# EAGLE design Sensors-V1 (EAGLE 9.6.2)
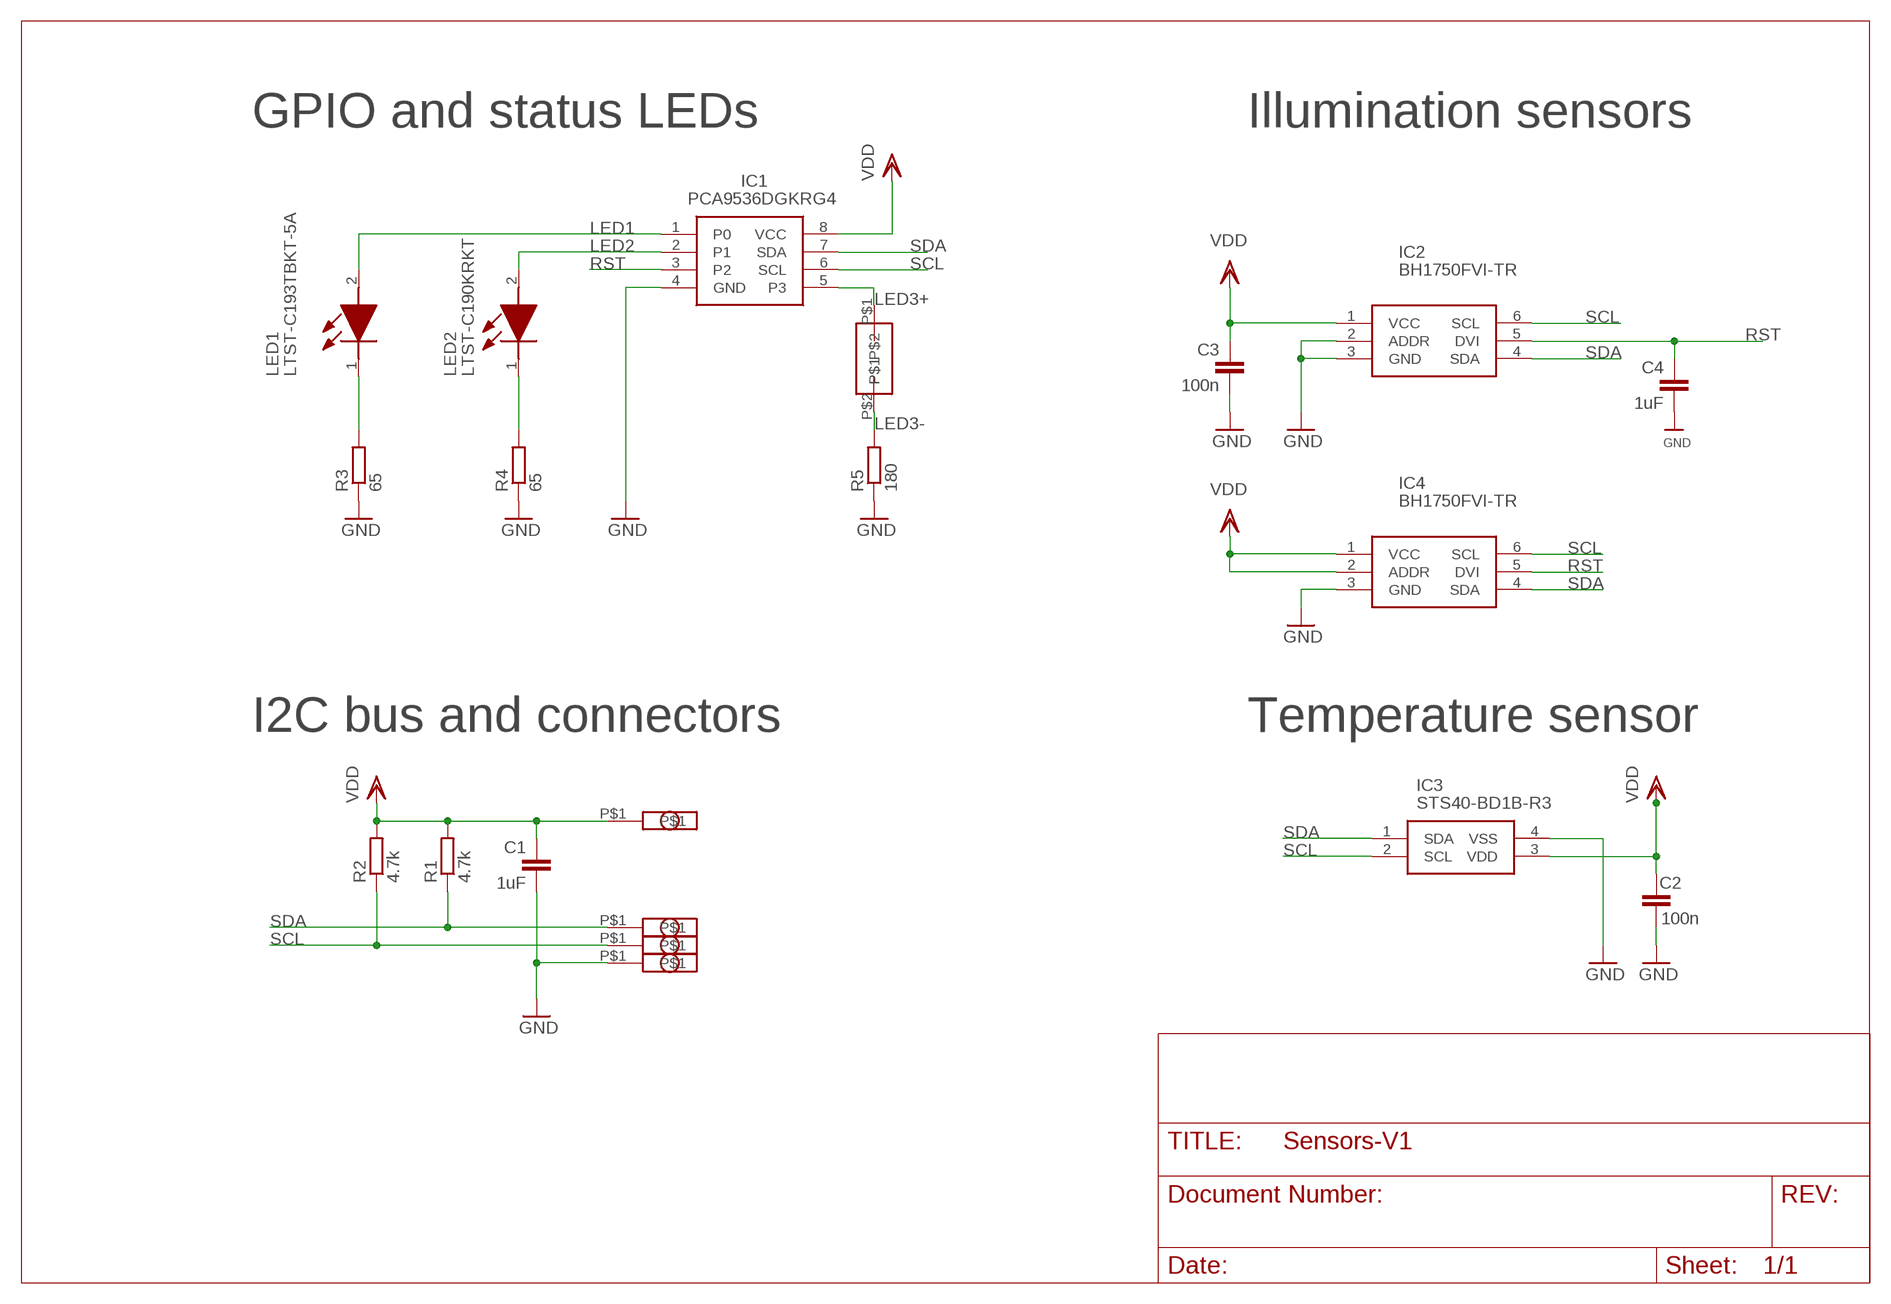
[diagram p0: schematic, sheet 1]

## Parts
C1  1uF  C-EUC0603  [C0603]
C2  100n  C-EUC0603  [C0603]
C3  100n  C-EUC0603  [C0603]
C4  1uF  C-EUC0603  [C0603]
IC1  PCA9536DGKRG4  [SOP65P490X110-8N]
IC2  BH1750FVI-TR  [WSOF6]
IC3  STS40-BD1B-R3  [STS40BD1BR3]
IC4  BH1750FVI-TR  [WSOF6]
LED1  LTST-C193TBKT-5A  [LEDC1608X45N]
LED2  LTST-C190KRKT  LTST-C190KFKT  [LEDC1607X80N]
R1  4.7k  R_JLMR0603  [R0603]
R2  4.7k  R_JLMR0603  [R0603]
R3  65  R_JLMR0603  [R0603]
R4  65  R_JLMR0603  [R0603]
R5  180  R_JLMR0603  [R0603]
U$1  PAD  [PAD-15]
U$2  PAD  [PAD-15]
U$3  PAD  [PAD-15]
U$4  PAD  [PAD-15]
U$5  LEDPINS  [LEDPINS254]

## Nets
GND: C1.2 C2.2 C3.2 C4.2 IC1.4(GND) IC2.2(ADDR) IC2.3(GND) IC3.4(VSS) IC4.3(GND) R3.1 R4.1 R5.1 U$3.P$1
LED1: IC1.1(P0) LED1.2(A)
LED2: IC1.2(P1) LED2.2(A)
LED3+: IC1.5(P3) U$5.P$1
LED3-: R5.2 U$5.P$2
N$1: LED1.1(K) R3.2
N$2: LED2.1(K) R4.2
RST: C4.1 IC1.3(P2) IC2.5(DVI) IC4.5(DVI)
SCL: IC1.6(SCL) IC2.6(SCL) IC3.2(SCL) IC4.6(SCL) R2.1 U$2.P$1
SDA: IC1.7(SDA) IC2.4(SDA) IC3.1(SDA) IC4.4(SDA) R1.1 U$1.P$1
VDD: C1.1 C2.1 C3.1 IC1.8(VCC) IC2.1(VCC) IC3.3(VDD) IC4.1(VCC) IC4.2(ADDR) R1.2 R2.2 U$4.P$1

## Notes on the sheet
- GPIO and status LEDs | Illumination sensors
- I2C bus and connectors | Temperature sensor

## Library data of the parts
C1-C4 = jlm_cap:C-EU: CAPACITOR, European symbol
IC1 = teensyamp:PCA9536DGKRG4: Interface - I/O Expanders Remote 4-Bit I2C and SMBus I/O Expander Source: Datasheet <https://www.ti.com/general/docs/suppproductinfo.tsp?distId=26&gotoUrl=http%3A%2F%2Fwww.ti.com%2Flit%2Fgpn%2Fpca9536>; DESCRIPTION: Interface - I/O Expanders Remote 4-Bit I2C and SMBus I/O Expander; HEIGHT: 1.1mm; MANUFACTURER_NAME: Texas Instruments; MANUFACTURER_PART_NUMBER: PCA9536DGKRG4; MOUSER_PART_NUMBER: 595-PCA9536DGKRG4; MOUSER_PRICE-STOCK: https://www.mouser.co.uk/ProductDetail/Texas-Instruments/PCA9536DGKRG4?qs=aEuGZpxfbxXPE5BN2fagwA%3D%3D
IC2 IC4 = teensyamp:BH1750FVI-TR: Ambient Light Sensor,16bit,I2C,WSOF6I ROHM BH1750FVI-TR Ambient Light Sensor Unit Surface Mount Source: Datasheet <https://componentsearchengine.com/Datasheets/2/BH1750FVI-TR.pdf>; DESCRIPTION: Ambient Light Sensor,16bit,I2C,WSOF6I ROHM BH1750FVI-TR Ambient Light Sensor Unit Surface Mount; HEIGHT: mm; MANUFACTURER_NAME: ROHM Semiconductor; MANUFACTURER_PART_NUMBER: BH1750FVI-TR
IC3 = teensyamp:STS40-BD1B-R3: Board Mount Temperature Sensors Base Accuracy Version, I2C Address 0x45 Source: Datasheet <https://sensirion.com/media/documents/D2D0B4A9/62CBE395/Sensirion_Datasheet_STS4x.pdf>; DESCRIPTION: Board Mount Temperature Sensors Base Accuracy Version, I2C Address 0x45; HEIGHT: 0.65mm; MANUFACTURER_NAME: Sensirion; MANUFACTURER_PART_NUMBER: STS40-BD1B-R3; MOUSER_PART_NUMBER: 403-STS40-BD1B-R3; MOUSER_PRICE-STOCK: https://www.mouser.co.uk/ProductDetail/Sensirion/STS40-BD1B-R3?qs=MyNHzdoqoQIARL3xuvj19A%3D%3D
LED1 = teensyamp:LTST-C193TBKT-5A: Standard LEDs - SMD Blue 470nm 28mcd 20mA Source: Datasheet <https://componentsearchengine.com/Datasheets/1/LTST-C193TBKT-5A.pdf>; DESCRIPTION: Standard LEDs - SMD Blue 470nm 28mcd 20mA; HEIGHT: 0.45mm; MANUFACTURER_NAME: Lite-On; MANUFACTURER_PART_NUMBER: LTST-C193TBKT-5A; MOUSER_PART_NUMBER: 859-LTSTC193TBKT5A; MOUSER_PRICE-STOCK: https://www.mouser.co.uk/ProductDetail/Lite-On/LTST-C193TBKT-5A?qs=xIkB7y1OTorvzzuuxuVkOA%3D%3D
LED2 = teensyamp:LTST-C190KFKT: LED,SMD,0603,Orange,60mcd,130deg Lite-On LTST-C190KFKT Orange LED, 605 nm, 1608 (0603), Rectangle Lens SMD Package Source: Datasheet <https://datasheet.datasheetarchive.com/originals/distributors/Datasheets-305/79294.pdf>; DESCRIPTION: LED,SMD,0603,Orange,60mcd,130deg Lite-On LTST-C190KFKT Orange LED, 605 nm, 1608 (0603), Rectangle Lens SMD Package; HEIGHT: 0.8mm; MANUFACTURER_NAME: Lite-On; MANUFACTURER_PART_NUMBER: LTST-C190KFKT; MOUSER_PART_NUMBER: 859-LTST-C190KFKT; MOUSER_PRICE-STOCK: https://www.mouser.co.uk/ProductDetail/LITEON/LTST-C190KFKT?qs=6QHXI9jVcTyVErVIqD1vhg%3D%3D
R1-R5 = jlm_resistors:R_JLM: RESISTOR, European symbol
U$1-U$4 = teensyamp:PAD: Pad for soldering signals
U$5 = teensyamp:LEDPINS: 2.54mm LED pins

## Net classes
1 highpower: width 0.406 mm, drill 0.483 mm
2 lowpower: width 0.305 mm, drill 0.483 mm

## Board
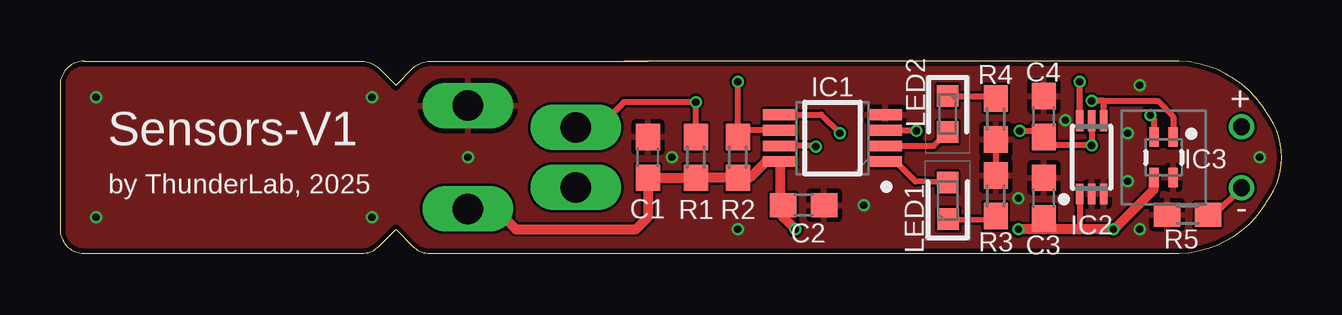
[diagram p1: board, top side]
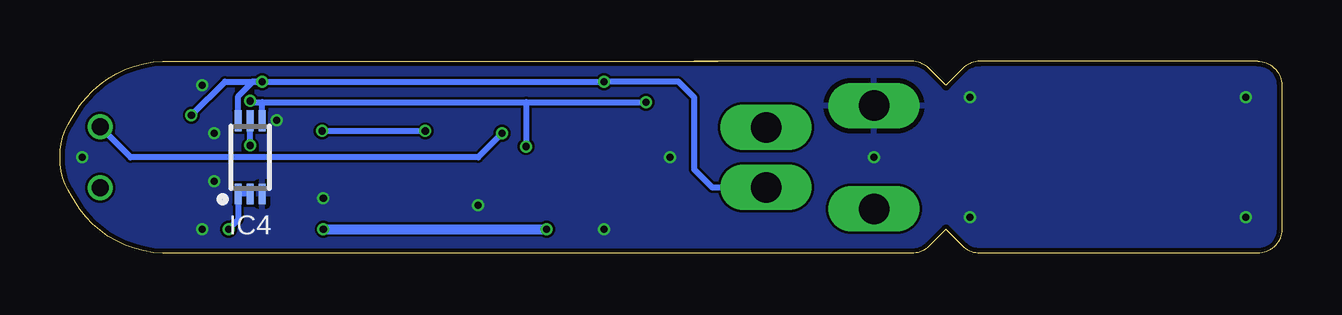
[diagram p2: board, bottom side, seen from below]

Size 50.93 x 8.01 mm. Coordinates in mm from the lower left corner, seen from the top.
Outline: 23.5,0 26.5,0
Outline: 26.5,0 46.24,0 arc57 50.1,1.83 50.45,2.38 arc66 50.45,5.63 50.1,6.18 arc57 46.24,8 24.5,8
Outline: 24.5,8 23.5,8
Outline: 24.5,8 15.41,8 arc45 14.71,7.71 14,7 13.29,7.71 arc45 12.59,8 1,8 arc90 0,7 0,1 arc90 1,0 12.59,0 arc45 13.29,0.3 14,1 14.71,0.3 arc45 15.41,0 26.5,0
Copper layers (1*16): Top 0.018mm / dielectric 1.55mm / Bottom 0.018mm
Design rules "Multi-CB_2L_100цm-Tracks_OL35цm *": minimum track width 0.1mm, minimum drill 0.2mm, track to track 0.1mm, track to pad 0.1mm, pad to pad 0.1mm, via to via 0.1mm, smd to smd 0mil, copper to edge 0.2mm, drill to drill 0.2mm, minimum pad ring 0.125mm, minimum via ring 0.1mm, stop-mask expansion 2mil, vias tented up to drill 0mil, thermal gap 0.2mm

### Footprints (pad centres in the part's own frame; a part is rotated, then mirrored left to right if it is on the bottom)
C0603 = smd 1.1 x 1: 1 -0.85,0; 2 0.85,0
SOP65P490X110-8N = smd 1.4 x 0.45: 1 -2.2,0.975; 2 -2.2,0.325; 3 -2.2,-0.325; 4 -2.2,-0.975; 5 2.2,-0.975; 6 2.2,-0.325; 7 2.2,0.325; 8 2.2,0.975
WSOF6 = smd 0.864 x 0.305: 1 -1.524,0.5; 2 -1.524,0; 3 -1.524,-0.5; 4 1.524,-0.5; 5 1.524,0; 6 1.524,0.5
STS40BD1BR3 = smd 0.813 x 0.406: 1 -0.838,0.4; 2 -0.838,-0.4; 3 0.838,-0.4; 4 0.838,0.4
LEDC1608X45N = smd 0.889 x 0.889: 1 -0.775,-0.025; 2 0.749,0
LEDC1607X80N = smd 0.889 x 0.889: 1 -0.75,0; 2 0.75,0
R0603 = smd 1.1 x 1: 1 -0.85,0; 2 0.85,0
PAD-15 = drill 1.27 long: P$1 0,0
LEDPINS254 = drill 0.7: P$1 0,1.27; P$2 0,-1.27

### Placement (x,y rotation side)
C1  24.5,4 90 top
C2  31,2 0 top
C3  41,2.3 90 top
C4  41,5.7 90 top
IC1  32.2,4.8 180 top
IC2  43,4 90 top
IC3  46,4 270 top
IC4  43,4 90 bottom
LED1  37,2.2 90 top
LED2  37,5.8 270 top
R1  26.5,4 270 top
R2  28.25,4 270 top
R3  39,2.4 270 top
R4  39,5.6 90 top
R5  47,1.6 0 top
U$1  21.5,5.25 90 top
U$2  21.5,2.75 90 top
U$3  17,6.15 90 top
U$4  17,1.85 90 top
U$5  49.25,4 0 top

### Tracks (layer width: path | path; a pad name or v marks a point on that pad's centre or on a via)
GND  (via drill 0.3)
  Top 0.254: R4.1 R3.1
  other vias: 50,4 39.95,2.3 33.5,2 28.25,1 45,1 25.5,4 45,7 1.5,6.5 1.5,1.5 13,1.5 13,6.5 17,4 41.9,5.55 44.5,3 44.5,5
  pour Top: 48.5,0 0,0 0,8 48.5,8 52.5,4
  pour Bottom: 48.5,0 0,0 0,8 48.5,8 52.5,4
LED1
  Top 0.254: IC1.1 34.84,3.83 35.66,3 LED1.2
LED2
  Top 0.254: IC1.2 36.42,4.48 LED2.2
LED3+  (via drill 0.3)
  Top 0.254: IC1.5 31.73,5.78 v32.5,5.01
  Bottom 0.254: v32.5,5.01 v32.5,5 33.5,4 47.98,4 U$5.P$1
LED3-
  Top 0.254: R5.2 48.12,1.6 U$5.P$2
N$1
  Top 0.254: LED1.1 38.85,1.4 R3.2
N$2
  Top 0.254: LED2.1 38.9,6.55 R4.2
RST  (via drill 0.3)
  Top 0.254: IC4.5 v43,4.5 v42.99,4.5 41.35,4.5 C4.1 40.75,5.1 v40,5.1 | IC1.3 35.67,5.13 v35.7,5.1
  Bottom 0.254: v40,5.1 v35.7,5.1 | v43,4.5 IC4.5
SCL  (via drill 0.3)
  Top 0.254: v28.25,7.15 R2.1 28.25,4.75 28.62,5.13 IC1.6 | IC2.6 v42.5,7.15 | v45.45,5.75 45.6,5.6 IC3.2
  Bottom 0.254: v42.5,7.15 v28.25,7.15 25.15,7.15 24.5,6.5 24.5,3.5 23.75,2.75 U$2.P$1 | v42.5,7.15 44.05,7.15 v45.45,5.75 | IC4.6 43.5,6.55 42.9,7.15 v42.5,7.15
SDA  (via drill 0.3)
  Top 0.254: v31.5,4.45 31.48,4.48 IC1.7 | 43.5,6.35 v43,6.35 | U$1.P$1 22.45,5.25 23.5,6.3 v26.5,6.3 R1.1 | IC2.4 43.5,6.35 | IC3.1 46.4,5.7 45.75,6.35 43.5,6.35
  Bottom 0.254: 42.5,6.3 31.5,6.3 | 31.5,6.3 v26.5,6.3 | IC4.4 42.5,6.3 | v43,6.35 42.95,6.3 42.5,6.3 | 31.5,6.3 v31.5,4.45
VDD  (via drill 0.3)
  Top 0.254: C3.1 41,1 | IC2.1 42.5,1 | 45.59,3.15 IC3.3
  Top 0.406: v39.95,1 41,1 42.5,1 v43.9,1 43.94,1 45.59,2.65 45.59,3.15 | U$4.P$1 18.15,1.85 19,1 24,1 24.5,1.5 C1.1 R1.2 R2.2 28.75,3.15 29.43,3.83 IC1.8 30,2 C2.1 30.15,1.5 v30.65,1
  Bottom 0.254: IC4.2 IC4.1 43.5,1.4 v43.9,1
  Bottom 0.406: v39.95,1 v30.65,1

### Text on the board
tNames: + | by ThunderLab, 2025 | -